# Altium project BEAGLEBONEBLACK_REV A5B.PrjPcb (part 5 of 5)

## Sheet P10_HDMI Framer.SchDoc
size 386 x 246 mm
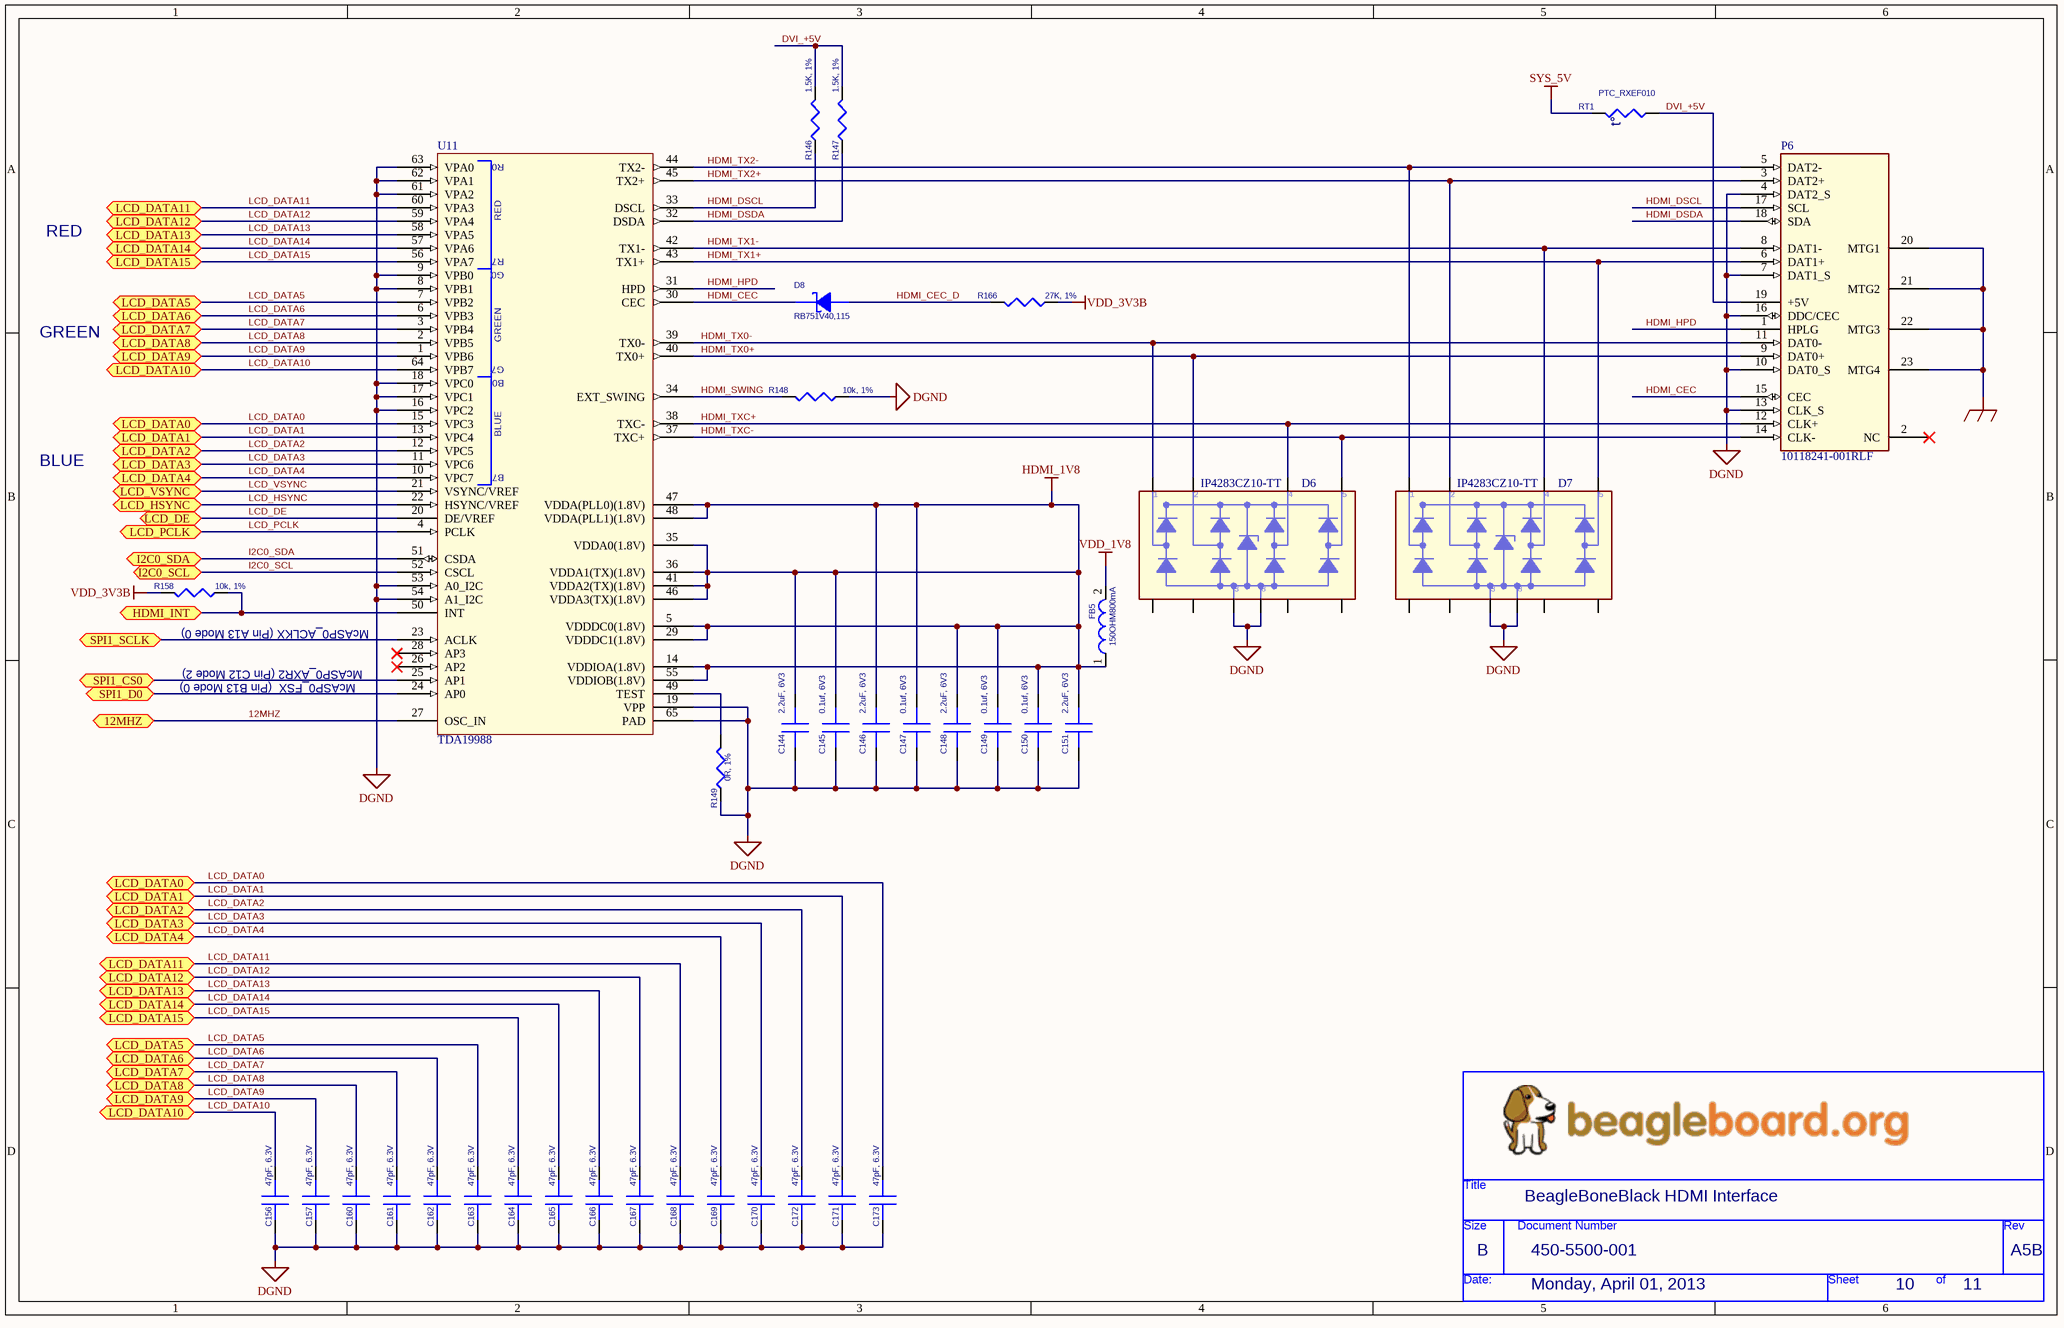
[diagram p12: P10_HDMI Framer.SchDoc]

### Parts
(Parts that share a designator on the sheet are numbered #1, #2 ... from top to bottom, then left to right.)
*#10  Page Create Date: Monday, April 01, 2013  Doc: 450-5500-001  RevCode: A5B  Title: BeagleBoneBlack HDMI Interface  Page Size: B  Page Number: 10  Page Count: 11  (hidden comment: BeagleBoard_org)  (graphical)
C144  2.2uF, 6V3  [402]
C145  0.1uf, 6V3  [402]
C146  2.2uF, 6V3  [402]
C147  0.1uf, 6V3  [402]
C148  2.2uF, 6V3  [402]
C149  0.1uf, 6V3  [402]
C150  0.1uf, 6V3  [402]
C151  2.2uF, 6V3  [402]
C156  47pF, 6.3V  [402]
C157  47pF, 6.3V  [402]
C160  47pF, 6.3V  [402]
C161  47pF, 6.3V  [402]
C162  47pF, 6.3V  [402]
C163  47pF, 6.3V  [402]
C164  47pF, 6.3V  [402]
C165  47pF, 6.3V  [402]
C166  47pF, 6.3V  [402]
C167  47pF, 6.3V  [402]
C168  47pF, 6.3V  [402]
C169  47pF, 6.3V  [402]
C170  47pF, 6.3V  [402]
C171  47pF, 6.3V  [402]
C172  47pF, 6.3V  [402]
C173  47pF, 6.3V  [402]
D6  IP4283CZ10-TT  [TSSOP10]
D7  IP4283CZ10-TT  [TSSOP10]
D8  RB751V40,115  [SOD323]
FB5  150OHM800mA  [SM-7351-IND-0805]
P6  10118241-001RLF  [CONN19_HDMI]
R146  1.5K, 1%  [402]
R147  1.5K, 1%  [402]
R148  10k, 1%  [402]
R149  0R, 1%  [402]
R158  10k, 1%  [402]
R166  27K, 1%  [402]
RT1  PTC_RXEF010  [POLYSW200-5638-310]
U11  TDA19988  [QFN64S9X9P5]

### Ports
12MHZ, HDMI_INT, I2C0_SCL, I2C0_SDA, LCD_DATA0, LCD_DATA1, LCD_DATA2, LCD_DATA3, LCD_DATA4, LCD_DATA5, LCD_DATA6, LCD_DATA7, LCD_DATA8, LCD_DATA9, LCD_DATA10, LCD_DATA11, LCD_DATA12, LCD_DATA13, LCD_DATA14, LCD_DATA15, LCD_DE, LCD_HSYNC, LCD_PCLK, LCD_VSYNC, SPI1_CS0, SPI1_D0, SPI1_SCLK

### Nets
DGND: C144.2 C145.2 C146.2 C147.2 C148.2 C149.2 C150.2 C151.2 C156.2 C157.2 C160.2 C161.2 C162.2 C163.2 C164.2 C165.2 C166.2 C167.2 C168.2 C169.2 C170.2 C171.2 C172.2 C173.2 D6.3 D6.8 D7.3 D7.8 P6.4(DAT2_S) P6.7(DAT1_S) P6.10(DAT0_S) P6.13(CLK_S) P6.16(DDC/CEC) R148.2(P2) R149.2(P2) U11.8(VPB1) U11.9(VPB0) U11.16(VPC2) U11.17(VPC1) U11.18(VPC0) U11.19(VPP) U11.53(A0_I2C) U11.54(A1_I2C) U11.61(VPA2) U11.62(VPA1) U11.63(VPA0) U11.65(PAD)
GND_EARTH: P6.20(MTG1) P6.21(MTG2) P6.22(MTG3) P6.23(MTG4)
HDMI_1V8: C144.1 C145.1 C146.1 C147.1 C148.1 C149.1 C150.1 C151.1 FB5.1 U11.5(VDDDC0(1.8V)) U11.14(VDDIOA(1.8V)) U11.29(VDDDC1(1.8V)) U11.35(VDDA0(1.8V)) U11.36(VDDA1(TX)(1.8V)) U11.41(VDDA2(TX)(1.8V)) U11.46(VDDA3(TX)(1.8V)) U11.47(VDDA(PLL0)(1.8V)) U11.48(VDDA(PLL1)(1.8V)) U11.55(VDDIOB(1.8V))
SYS_5V: RT1.1(P1)
VDD_1V8: FB5.2
VDD_3V3B: R158.1(P1) R166.2(P2)
12MHZ: U11.27(OSC_IN) ; port 12MHZ
DVI_+5V: P6.19(+5V) R146.1(P1) R147.1(P1) RT1.2(P2)
HDMI_CEC: D8.1(C) P6.15(CEC) U11.30(CEC)
HDMI_CEC_D: D8.2(A) R166.1(P1)
HDMI_DSCL: P6.17(SCL) R146.2(P2) U11.33(DSCL)
HDMI_DSDA: P6.18(SDA) R147.2(P2) U11.32(DSDA)
HDMI_HPD: P6.1(HPLG) U11.31(HPD)
HDMI_INT: R158.2(P2) U11.50(INT) ; port HDMI_INT
HDMI_SWING: R148.1(P1) U11.34(EXT_SWING)
HDMI_TX0+: D6.2 P6.9(DAT0+) U11.40(TX0+)
HDMI_TX0-: D6.1 P6.11(DAT0-) U11.39(TX0-)
HDMI_TX1+: D7.5 P6.6(DAT1+) U11.43(TX1+)
HDMI_TX1-: D7.4 P6.8(DAT1-) U11.42(TX1-)
HDMI_TX2+: D7.2 P6.3(DAT2+) U11.45(TX2+)
HDMI_TX2-: D7.1 P6.5(DAT2-) U11.44(TX2-)
HDMI_TXC+: D6.4 P6.12(CLK+) U11.38(TXC-)
HDMI_TXC-: D6.5 P6.14(CLK-) U11.37(TXC+)
I2C0_SCL: U11.52(CSCL) ; port I2C0_SCL
I2C0_SDA: U11.51(CSDA) ; port I2C0_SDA
LCD_DATA0: C173.1 U11.15(VPC3) ; port LCD_DATA0
LCD_DATA1: C171.1 U11.13(VPC4) ; port LCD_DATA1
LCD_DATA2: C172.1 U11.12(VPC5) ; port LCD_DATA2
LCD_DATA3: C170.1 U11.11(VPC6) ; port LCD_DATA3
LCD_DATA4: C169.1 U11.10(VPC7) ; port LCD_DATA4
LCD_DATA5: C163.1 U11.7(VPB2) ; port LCD_DATA5
LCD_DATA6: C162.1 U11.6(VPB3) ; port LCD_DATA6
LCD_DATA7: C161.1 U11.3(VPB4) ; port LCD_DATA7
LCD_DATA8: C160.1 U11.2(VPB5) ; port LCD_DATA8
LCD_DATA9: C157.1 U11.1(VPB6) ; port LCD_DATA9
LCD_DATA10: C156.1 U11.64(VPB7) ; port LCD_DATA10
LCD_DATA11: C168.1 U11.60(VPA3) ; port LCD_DATA11
LCD_DATA12: C167.1 U11.59(VPA4) ; port LCD_DATA12
LCD_DATA13: C166.1 U11.58(VPA5) ; port LCD_DATA13
LCD_DATA14: C165.1 U11.57(VPA6) ; port LCD_DATA14
LCD_DATA15: C164.1 U11.56(VPA7) ; port LCD_DATA15
LCD_DE: U11.20(DE/VREF) ; port LCD_DE
LCD_HSYNC: U11.22(HSYNC/VREF) ; port LCD_HSYNC
LCD_PCLK: U11.4(PCLK) ; port LCD_PCLK
LCD_VSYNC: U11.21(VSYNC/VREF) ; port LCD_VSYNC
SPI1_CS0: U11.25(AP1) ; port SPI1_CS0
SPI1_D0: U11.24(AP0) ; port SPI1_D0
SPI1_SCLK: U11.23(ACLK) ; port SPI1_SCLK
NetR149_1: R149.1(P1) U11.49(TEST)

Not connected (* = marked no-connect by the designer): D6 6 7 9 10; D7 6 7 9 10; P6 2(NC)*; U11 26(AP2)* 28(AP3)*

### Notes on the sheet
- RED
- GREEN
- BLUE
- McASP0_AXR2 (Pin C12 Mode 2)
- (near R158) McASP0_ACLKX (Pin A13 Mode 0)
- McASP0_FSX  (Pin B13 Mode 0)
- (in symbol BeagleBoard_org) Title; Size; Document Number; Rev; Date:; Sheet; of
- (in symbol PTC) t°
- (in symbol TDA19988) R0; RED; R7; G0; GREEN; G7; B0; BLUE; B7

### Library data of the parts
C144 C146 C148 C151 = CAP SMD: CAP CER 2.2UF 6.3V 10% X5R 0402; Manufacturer: TDK Corporation; Manufacturer Part Number: C1005X5R0J225K050BC; Capacitance: 2.2µF; Supplier 1: Digi-Key; Supplier Part Number 1: 445-6847-6-ND; RoHS: RoHS Compliant; Category: Capacitors; Stock 1: 186346; Pricing 1: 1=0.24, 10=0.2, 100=0.1, 250=0.075, 500=0.06626, 1000=0.05875, 5000=0.04875 (USD); Voltage - Rated: 6.3V; Tolerance: ±10%; Temperature Coefficient: X5R; Mounting Type: Surface Mount, MLCC; Operating Temperature: -55°C ~ 85°C; Applications: General Purpose; Ratings: -; Package / Case: 0402 (1005 Metric); Size / Dimension: 0.039" L x 0.020" W (1.00mm x 0.50mm); Height - Seated (Max): -; Thickness (Max): 0.022" (0.55mm); Lead Spacing: -; Features: -; Packaging: Digi-Reel®; Lead Style: -; ComponentLink1URL: http://product.tdk.com/capacitor/mlcc/en/documents/mlcc_commercial_general_en.pdf; ComponentLink1Description: http://product.tdk.com/capacitor/mlcc/en/documents/mlcc_commercial_general_en.pdf
C145 C147 C149 C150 = CAP SMD: CAP CER 0.1UF 6.3V 10% X5R 0402; Manufacturer: TDK Corporation; Manufacturer Part Number: C1005X5R0J104K050BA; Capacitance: 0.1µF; Supplier 1: Digi-Key; Supplier Part Number 1: 445-1266-6-ND; RoHS: RoHS Compliant; Category: Capacitors; Stock 1: 127094; Pricing 1: 1=0.1, 10=0.026, 100=0.0121, 250=0.00992, 500=0.00848, 1000=0.0066, 5000=0.0055 (USD); Voltage - Rated: 6.3V; Tolerance: ±10%; Temperature Coefficient: X5R; Mounting Type: Surface Mount, MLCC; Operating Temperature: -55°C ~ 85°C; Applications: General Purpose; Ratings: -; Package / Case: 0402 (1005 Metric); Size / Dimension: 0.039" L x 0.020" W (1.00mm x 0.50mm); Height - Seated (Max): -; Thickness (Max): 0.022" (0.55mm); Lead Spacing: -; Features: -; Packaging: Digi-Reel®; Lead Style: -; ComponentLink1URL: http://product.tdk.com/capacitor/mlcc/en/documents/mlcc_commercial_general_en.pdf; ComponentLink1Description: http://product.tdk.com/capacitor/mlcc/en/documents/mlcc_commercial_general_en.pdf
C156 C157 C160-C173 = CAP SMD: CAP CER 47PF 50V 5% NP0 0402; Manufacturer: TDK Corporation; Manufacturer Part Number: C1005C0G1H470J050BA; Temperature Coefficient: C0G, NP0; Supplier 1: Digi-Key; Supplier Part Number 1: 445-1243-6-ND; RoHS: RoHS Compliant; Category: Capacitors; Stock 1: 0; Pricing 1: 1=0.1, 10=0.024, 100=0.011, 250=0.009, 500=0.0077, 1000=0.006, 5000=0.005 (USD); Capacitance: 47pF; Voltage - Rated: 50V; Tolerance: ±5%; Mounting Type: Surface Mount, MLCC; Operating Temperature: -55°C ~ 125°C; Applications: General Purpose; Ratings: -; Package / Case: 0402 (1005 Metric); Size / Dimension: 0.039" L x 0.020" W (1.00mm x 0.50mm); Height - Seated (Max): -; Thickness (Max): 0.022" (0.55mm); Lead Spacing: -; Features: -; Packaging: Digi-Reel®; Lead Style: -; ComponentLink1URL: http://product.tdk.com/capacitor/mlcc/en/documents/mlcc_commercial_general_en.pdf; ComponentLink1Description: http://product.tdk.com/capacitor/mlcc/en/documents/mlcc_commercial_general_en.pdf
D6 D7 = 32CTQ030/TO_1: DIODE ESD PROT HDMI 10TSSOP; Manufacturer: NXP Semiconductors; Manufacturer Part Number: IP4283CZ10-TT,118; Voltage - Reverse Standoff (Typ): 3V; Voltage - Breakdown: 6V; Polarization: 4 Channel Array - Unidirectional; Supplier 1: Digi-Key; Supplier Part Number 1: 568-5875-6-ND; RoHS: RoHS Compliant; Category: Circuit Protection; Stock 1: 1067; Pricing 1: 1=0.85, 10=0.743, 25=0.6568, 100=0.5724, 250=0.49828, 500=0.42416, 1000=0.33974 (USD); Power (Watts): -; Mounting Type: Surface Mount; Package / Case: 10-TFSOP, 10-MSOP (0.118", 3.00mm Width); Supplier Device Package: 10-TSSOP; Packaging: Digi-Reel®; ComponentLink1URL: http://media.digikey.com/pdf/Data%20Sheets/NXP%20PDFs/IP4283CZ10.pdf; ComponentLink1Description: http://media.digikey.com/pdf/Data%20Sheets/NXP%20PDFs/IP4283CZ10.pdf
D8 = Zener: DIODE SCHOTTKY 40V 120MA SOD323; Manufacturer: NXP Semiconductors; Current - Average Rectified (Io): 120mA (DC); Voltage - Forward (Vf) (Max) @ If: 370mV @ 1mA; Speed: Small Signal =< 200mA (Io), Any Speed; Current - Reverse Leakage @ Vr: 500nA @ 30V; Capacitance @ Vr, F: 2pF @ 1V, 1MHz; Supplier 1: Digi-Key; Supplier Part Number 1: 568-8119-6-ND; Manufacturer Part Number: RB751V40,115; RoHS: RoHS Compliant; Category: Discrete Semiconductor Products; Stock 1: 5326; Pricing 1: 1=0.29, 10=0.26, 25=0.1872, 100=0.1456, 250=0.09152, 500=0.07798, 1000=0.05313 (USD); Diode Type: Schottky; Voltage - DC Reverse (Vr) (Max): 40V; Reverse Recovery Time (trr): -; Mounting Type: Surface Mount; Package / Case: SC-76, SOD-323; Supplier Device Package: SOD-323; Packaging: Digi-Reel®; ComponentLink1URL: http://www.nxp.com/documents/data_sheet/RB751_SER.pdf; ComponentLink1Description: http://www.nxp.com/documents/data_sheet/RB751_SER.pdf
FB5 = IND: FERRITE 800MA 150 OHM 0805 SMD; Manufacturer: Laird-Signal Integrity Products; Manufacturer Part Number: LI0805H151R-10; Impedance @ Frequency: 150 Ohm @ 100MHz; DC Resistance (DCR): 150 mOhm Max; Filter Type: Differential Mode - Single; Supplier 1: Digi-Key; Supplier Part Number 1: 240-2384-6-ND; RoHS: RoHS Compliant; Category: Filters; Stock 1: 10144; Pricing 1: 1=0.1, 10=0.07, 25=0.064, 50=0.0574, 100=0.0421, 250=0.03064, 500=0.02808, 1000=0.02424 (USD); Current Rating: 800mA; Package / Case: 0805 (2012 Metric); Mounting Type: Surface Mount; Packaging: Digi-Reel®; Height (Max): 0.043" (1.10mm); Size / Dimension: 0.079" L x 0.049" W (2.00mm x 1.25mm); ComponentLink1URL: http://www.lairdtech.com/WorkArea/linkit.aspx?LinkIdentifier=id&ItemID=4912; ComponentLink1Description: http://www.lairdtech.com/WorkArea/linkit.aspx?LinkIdentifier=id&ItemID=4912
P6 = Micro HDMI: CONN HDMI RECPT 19POS SMT R/A; Manufacturer: FCI; Number of Contacts: 19; Gender: Receptacle; Supplier 1: Digi-Key; Supplier Part Number 1: 609-4615-6-ND; Manufacturer Part Number: 10118241-001RLF; RoHS: RoHS Compliant; Category: Connectors, Interconnects; Stock 1: 6779; Pricing 1: 1=1.34, 10=1.174, 25=1.1052, 50=1.059, 100=1.013, 250=0.92092 (USD); Connector Type: HDMI; Specifications: -; Mounting Type: Surface Mount, Right Angle, Horizontal; Features: Shielded, Solder Retention; Packaging: Digi-Reel®; Ingress Protection: -; ComponentLink1URL: http://portal.fciconnect.com/Comergent//fci/drawing/10118241.pdf; ComponentLink1Description: http://portal.fciconnect.com/Comergent//fci/drawing/10118241.pdf
R146 R147 = RES SMD: RES 1.50K OHM 1/16W 1% 0402 SMD; Manufacturer: Yageo; Manufacturer Part Number: RC0402FR-071K5L; Power (Watts): 0.063W, 1/16W; Temperature Coefficient: ±100ppm/°C; Supplier 1: Digi-Key; Supplier Part Number 1: 311-1.50KLRDKR-ND; RoHS: RoHS Compliant; Category: Resistors; Stock 1: 434146; Pricing 1: 1=0.1, 10=0.014, 25=0.0104, 100=0.0063, 250=0.0054, 500=0.00382, 1000=0.0027, 2500=0.00234, 5000=0.00203 (USD); Resistance (Ohms): 1.5k; Composition: Thick Film; Features: -; Tolerance: ±1%; Package / Case: 0402 (1005 Metric); Supplier Device Package: 0402; Size / Dimension: 0.039" L x 0.020" W (1.00mm x 0.50mm); Height: 0.016" (0.40mm); Number of Terminations: 2; Packaging: Digi-Reel®; ComponentLink1URL: http://www.yageo.com/documents/recent/PYu-RC0402_51_RoHS_L_6.pdf; ComponentLink1Description: http://www.yageo.com/documents/recent/PYu-RC0402_51_RoHS_L_6.pdf
R148 R158 = RES SMD: RES 10K OHM 1/16W 5% 0402 SMD; Manufacturer: Rohm Semiconductor; Manufacturer Part Number: MCR01MZPJ103; Power (Watts): 0.063W, 1/16W; Temperature Coefficient: ±200ppm/°C; Supplier 1: Digi-Key; Supplier Part Number 1: RHM10KJDKR-ND; RoHS: RoHS Compliant; Category: Resistors; Stock 1: 460442; Pricing 1: 1=0.1, 10=0.019, 25=0.014, 100=0.0078, 250=0.00596, 500=0.00476, 1000=0.0035, 5000=0.00251 (USD); Resistance (Ohms): 10k; Composition: Thick Film; Features: Automotive AEC-Q200 Qualified; Tolerance: ±5%; Package / Case: 0402 (1005 Metric); Supplier Device Package: 0402 (1005 Metric); Size / Dimension: 0.039" L x 0.020" W (1.00mm x 0.50mm); Height: 0.016" (0.40mm); Number of Terminations: 2; Packaging: Digi-Reel®; ComponentLink1URL: http://rohmfs.rohm.com/en/products/databook/datasheet/passive/resistor/chip_resistor/mcr_a.pdf; ComponentLink1Description: http://rohmfs.rohm.com/en/products/databook/datasheet/passive/resistor/chip_resistor/mcr_a.pdf
R149 = RES SMD: RES 0.0 OHM 1/16W 0402 SMD; Manufacturer: Yageo; Manufacturer Part Number: RC0402JR-070RL; Resistance (Ohms): 0.0; Power (Watts): 0.063W, 1/16W; Tolerance: Jumper; Supplier 1: Digi-Key; Supplier Part Number 1: 311-0.0JRDKR-ND; RoHS: RoHS Compliant; Category: Resistors; Stock 1: 4565215; Pricing 1: 1=0.1, 10=0.012, 25=0.0092, 100=0.0055, 250=0.00476, 500=0.00336, 1000=0.00237, 2500=0.00206, 5000=0.00178 (USD); Composition: Thick Film; Features: -; Temperature Coefficient: -; Package / Case: 0402 (1005 Metric); Supplier Device Package: 0402; Size / Dimension: 0.039" L x 0.020" W (1.00mm x 0.50mm); Height: 0.016" (0.40mm); Number of Terminations: 2; Packaging: Digi-Reel®; ComponentLink1URL: http://www.yageo.com/documents/recent/PYu-RC0402_51_RoHS_L_6.pdf; ComponentLink1Description: http://www.yageo.com/documents/recent/PYu-RC0402_51_RoHS_L_6.pdf
R166 = RES SMD: RES 27.0K OHM 1/16W 1% 0402 SMD; Manufacturer: Yageo; Manufacturer Part Number: RC0402FR-0727KL; Power (Watts): 0.063W, 1/16W; Temperature Coefficient: ±100ppm/°C; Supplier 1: Digi-Key; Supplier Part Number 1: 311-27.0KLRDKR-ND; RoHS: RoHS Compliant; Category: Resistors; Stock 1: 115508; Pricing 1: 1=0.1, 10=0.014, 25=0.0104, 100=0.0063, 250=0.0054, 500=0.00382, 1000=0.0027, 2500=0.00234, 5000=0.00203 (USD); Resistance (Ohms): 27k; Composition: Thick Film; Features: -; Tolerance: ±1%; Package / Case: 0402 (1005 Metric); Supplier Device Package: 0402; Size / Dimension: 0.039" L x 0.020" W (1.00mm x 0.50mm); Height: 0.016" (0.40mm); Number of Terminations: 2; Packaging: Digi-Reel®; ComponentLink1URL: http://www.yageo.com/documents/recent/PYu-RC0402_51_RoHS_L_6.pdf; ComponentLink1Description: http://www.yageo.com/documents/recent/PYu-RC0402_51_RoHS_L_6.pdf
RT1 = PTC: POLYSWITCH PTC RESET 0.1A; Manufacturer: TE Connectivity; Current - Hold (Ih) (Max): 100mA; Current - Trip (It): 200mA; Current - Max: 40A; Voltage - Max: 60V; R Min/Max: 2.500 ~ 4.500 Ohm; Time to Trip: 4s; Supplier 1: Digi-Key; Supplier Part Number 1: RXEF010-ND; Manufacturer Part Number: RXEF010; RoHS: RoHS Compliant; Category: Circuit Protection; Stock 1: 22325; Pricing 1: 1=0.32, 10=0.289, 100=0.2625, 500=0.20476, 1000=0.1764, 5000=0.1617, 10000=0.1365, 50000=0.13125, 100000=0.126 (USD); Package / Case: Radial, Disc; Packaging: Bulk; ComponentLink1URL: http://documents.tycoelectronics.com/commerce/DocumentDelivery/DDEController?Action=showdoc&DocId=Specification+Or+Standard%7FSCD25213%7FE%7Fpdf%7FEnglish%7FENG_SS_SCD25213_E.pdf; ComponentLink1Description: http://documents.tycoelectronics.com/commerce/DocumentDelivery/DDEController?Action=showdoc&DocId=Specification+Or+Standard%7FSCD25213%7FE%7Fpdf%7FEnglish%7FENG_SS_SCD25213_E.pdf
U11 = TDA19988: IC HDMI TRANSMITTER 64-HVQFN; Manufacturer: NXP Semiconductors; Manufacturer Part Number: TDA19988AHN/C1,551; Supplier 1: Digi-Key; Supplier Part Number 1: TDA19988AHN/C1,551-ND; RoHS: RoHS Compliant; Category: Integrated Circuits (ICs); Stock 1: 0; Pricing 1: 260=4.59 (USD); Type: HDMI Transmitter; Applications: Set-Top Boxes; Mounting Type: Surface Mount; Package / Case: 64-VFQFN Exposed Pad; Supplier Device Package: 64-HVQFN (9x9); Packaging: Tray

## Sheet P11_Exp Conn, uSD, and .SchDoc
size 386 x 246 mm
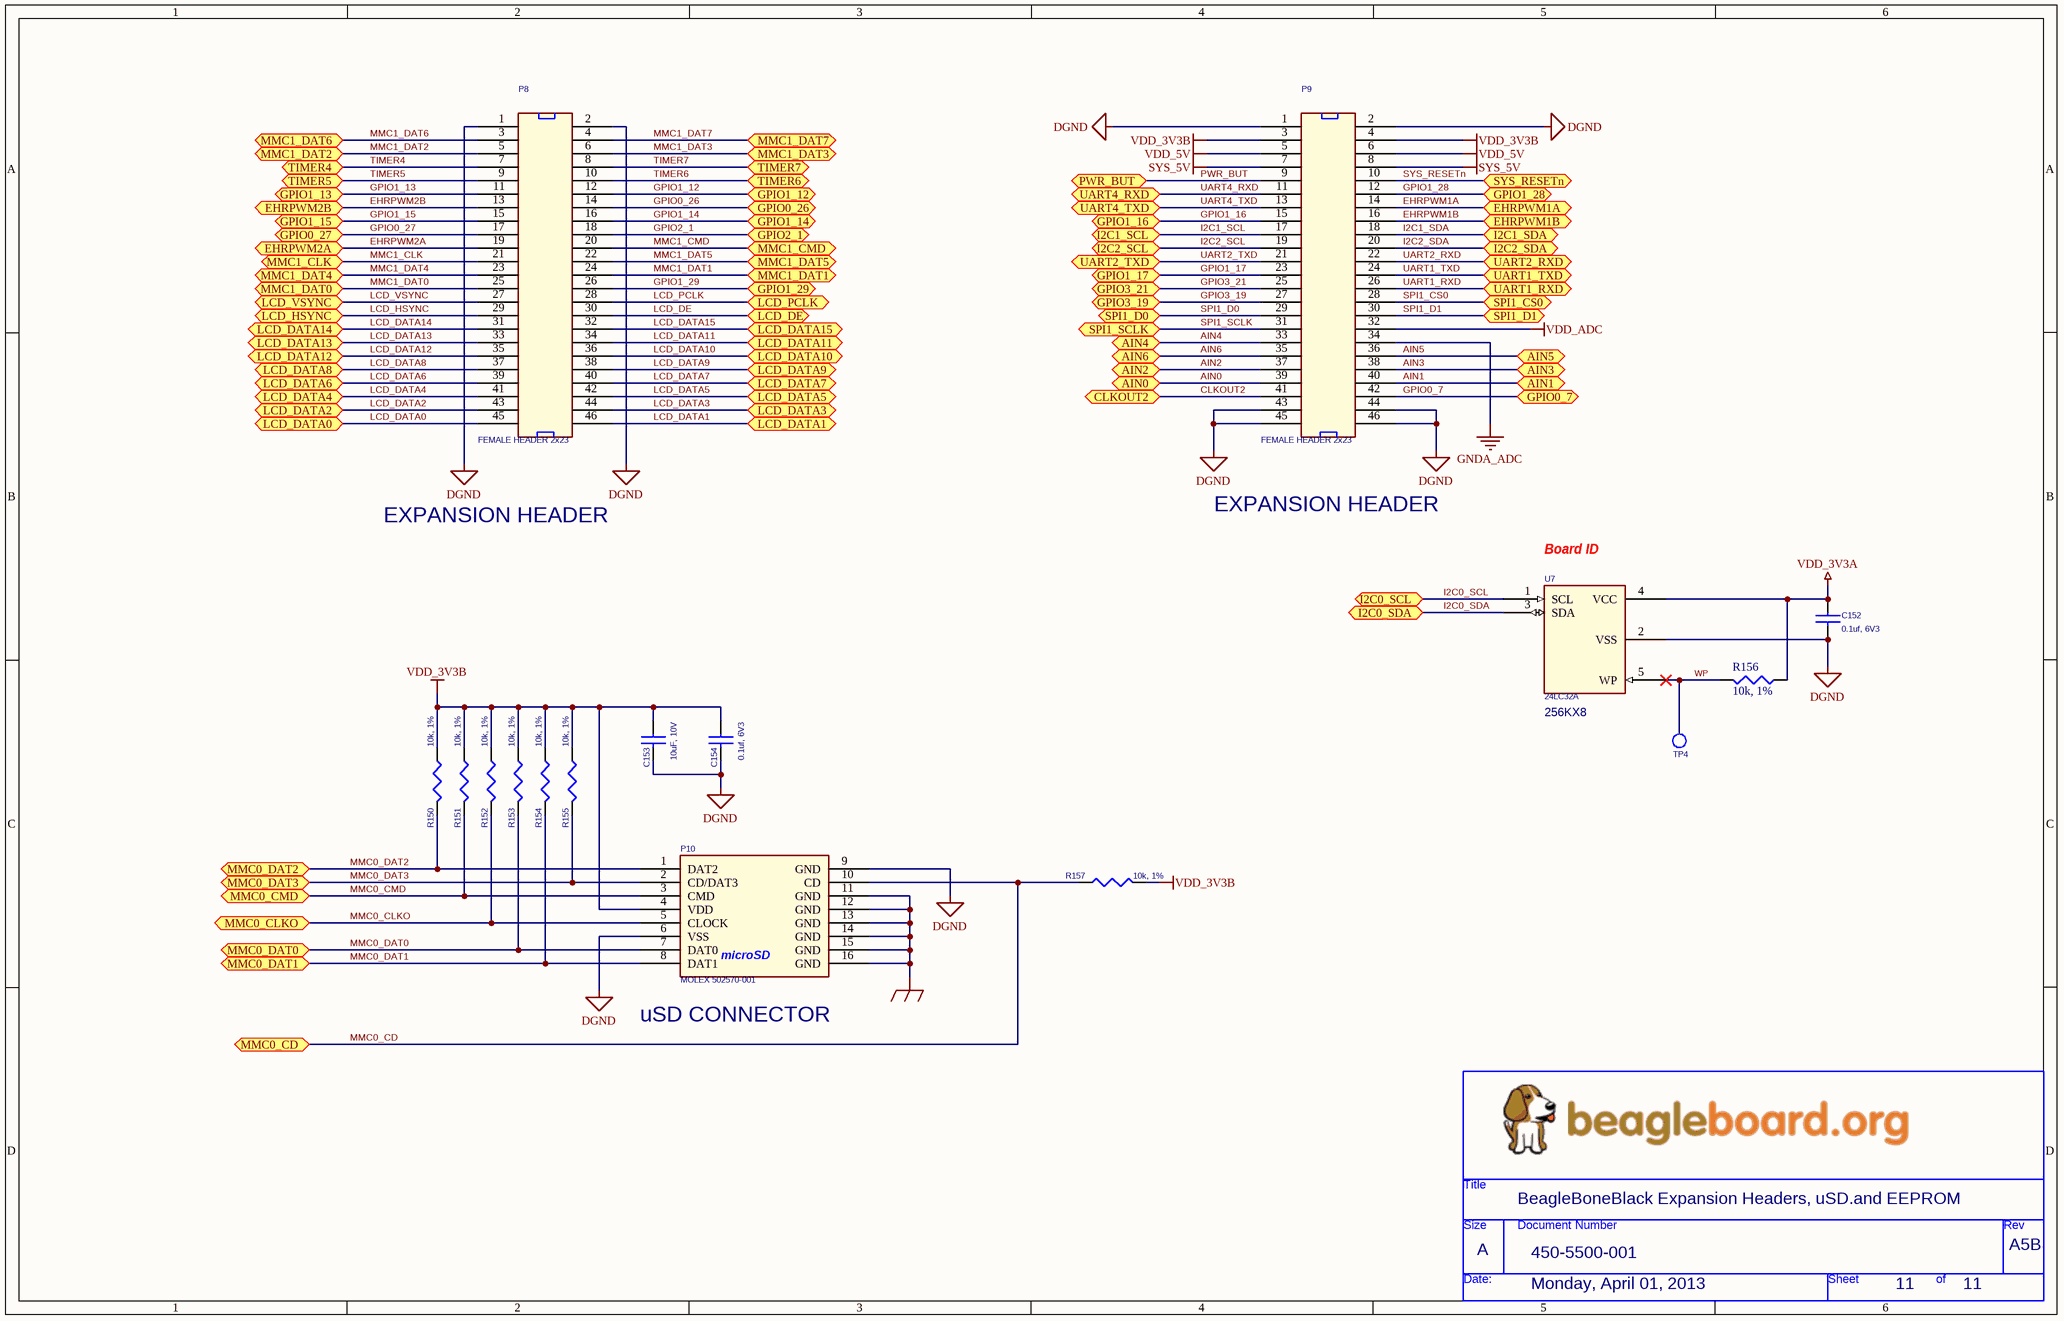
[diagram p13: P11_Exp Conn, uSD, and .SchDoc]

### Parts
(Parts that share a designator on the sheet are numbered #1, #2 ... from top to bottom, then left to right.)
*#11  Page Create Date: Monday, April 01, 2013  Doc: 450-5500-001  RevCode: A5B  Title: BeagleBoneBlack Expansion Headers, uSD.and EEPROM  Page Size: A  Page Number: 11  (hidden comment: BeagleBoard_org)  (graphical)
C152  0.1uf, 6V3  [402]
C153  10uF, 10V  [805]
C154  0.1uf, 6V3  [402]
P8  FEMALE HEADER 2x23  [HEADER23X2]
P9  FEMALE HEADER 2x23  [HEADER23X2]
P10  MOLEX 502570-001  [SD-MICRO-SCHA5B0300]
R150  10k, 1%  [402]
R151  10k, 1%  [402]
R152  10k, 1%  [402]
R153  10k, 1%  [402]
R154  10k, 1%  [402]
R155  10k, 1%  [402]
R156  10k, 1%  [402]
R157  10k, 1%  [402]
TP4  TESTPT1  [tp1-8040]  (value not drawn)  (no BOM)
U7  24LC32A  [SOT23-5]

### Ports
AIN0, AIN1, AIN2, AIN3, AIN4, AIN5, AIN6, CLKOUT2, EHRPWM1A, EHRPWM1B, EHRPWM2A, EHRPWM2B, GPIO0_7, GPIO0_26, GPIO0_27, GPIO1_12, GPIO1_13, GPIO1_14, GPIO1_15, GPIO1_16, GPIO1_17, GPIO1_28, GPIO1_29, GPIO2_1, GPIO3_19, GPIO3_21, I2C0_SCL, I2C0_SDA, I2C1_SCL, I2C1_SDA, I2C2_SCL, I2C2_SDA, LCD_DATA0, LCD_DATA1, LCD_DATA2, LCD_DATA3, LCD_DATA4, LCD_DATA5, LCD_DATA6, LCD_DATA7, LCD_DATA8, LCD_DATA9, LCD_DATA10, LCD_DATA11, LCD_DATA12, LCD_DATA13, LCD_DATA14, LCD_DATA15, LCD_DE, LCD_HSYNC, LCD_PCLK, LCD_VSYNC, MMC0_CD, MMC0_CLKO, MMC0_CMD, MMC0_DAT0, MMC0_DAT1, MMC0_DAT2, MMC0_DAT3, MMC1_CLK, MMC1_CMD, MMC1_DAT0, MMC1_DAT1, MMC1_DAT2, MMC1_DAT3, MMC1_DAT4, MMC1_DAT5, MMC1_DAT6, MMC1_DAT7, PWR_BUT, SPI1_CS0, SPI1_D0, SPI1_D1, SPI1_SCLK, SYS_RESETn, TIMER4, TIMER5, TIMER6, TIMER7, UART1_RXD, UART1_TXD, UART2_RXD, UART2_TXD, UART4_RXD, UART4_TXD

### Nets
DGND: C152.2 C153.2 C154.2 P8.1 P8.2 P9.1 P9.2 P9.43 P9.44 P9.45 P9.46 P10.6(VSS) P10.9(GND) U7.2(VSS)
GND_EARTH: P10.11(GND) P10.12(GND) P10.13(GND) P10.14(GND) P10.15(GND) P10.16(GND)
GNDA_ADC: P9.34
SYS_5V: P9.7 P9.8
VDD_3V3A: C152.1 R156.1 U7.4(VCC)
VDD_3V3B: C153.1 C154.1 P9.3 P9.4 P10.4(VDD) R150.1 R151.1 R152.1 R153.1 R154.1 R155.1 R157.2
VDD_5V: P9.5 P9.6
VDD_ADC: P9.32
AIN0: P9.39 ; port AIN0
AIN1: P9.40 ; port AIN1
AIN2: P9.37 ; port AIN2
AIN3: P9.38 ; port AIN3
AIN4: P9.33 ; port AIN4
AIN5: P9.36 ; port AIN5
AIN6: P9.35 ; port AIN6
CLKOUT2: P9.41 ; port CLKOUT2
EHRPWM1A: P9.14 ; port EHRPWM1A
EHRPWM1B: P9.16 ; port EHRPWM1B
EHRPWM2A: P8.19 ; port EHRPWM2A
EHRPWM2B: P8.13 ; port EHRPWM2B
GPIO0_7: P9.42 ; port GPIO0_7
GPIO0_26: P8.14 ; port GPIO0_26
GPIO0_27: P8.17 ; port GPIO0_27
GPIO1_12: P8.12 ; port GPIO1_12
GPIO1_13: P8.11 ; port GPIO1_13
GPIO1_14: P8.16 ; port GPIO1_14
GPIO1_15: P8.15 ; port GPIO1_15
GPIO1_16: P9.15 ; port GPIO1_16
GPIO1_17: P9.23 ; port GPIO1_17
GPIO1_28: P9.12 ; port GPIO1_28
GPIO1_29: P8.26 ; port GPIO1_29
GPIO2_1: P8.18 ; port GPIO2_1
GPIO3_19: P9.27 ; port GPIO3_19
GPIO3_21: P9.25 ; port GPIO3_21
I2C0_SCL: U7.1(SCL) ; port I2C0_SCL
I2C0_SDA: U7.3(SDA) ; port I2C0_SDA
I2C1_SCL: P9.17 ; port I2C1_SCL
I2C1_SDA: P9.18 ; port I2C1_SDA
I2C2_SCL: P9.19 ; port I2C2_SCL
I2C2_SDA: P9.20 ; port I2C2_SDA
LCD_DATA0: P8.45 ; port LCD_DATA0
LCD_DATA1: P8.46 ; port LCD_DATA1
LCD_DATA2: P8.43 ; port LCD_DATA2
LCD_DATA3: P8.44 ; port LCD_DATA3
LCD_DATA4: P8.41 ; port LCD_DATA4
LCD_DATA5: P8.42 ; port LCD_DATA5
LCD_DATA6: P8.39 ; port LCD_DATA6
LCD_DATA7: P8.40 ; port LCD_DATA7
LCD_DATA8: P8.37 ; port LCD_DATA8
LCD_DATA9: P8.38 ; port LCD_DATA9
LCD_DATA10: P8.36 ; port LCD_DATA10
LCD_DATA11: P8.34 ; port LCD_DATA11
LCD_DATA12: P8.35 ; port LCD_DATA12
LCD_DATA13: P8.33 ; port LCD_DATA13
LCD_DATA14: P8.31 ; port LCD_DATA14
LCD_DATA15: P8.32 ; port LCD_DATA15
LCD_DE: P8.30 ; port LCD_DE
LCD_HSYNC: P8.29 ; port LCD_HSYNC
LCD_PCLK: P8.28 ; port LCD_PCLK
LCD_VSYNC: P8.27 ; port LCD_VSYNC
MMC0_CD: P10.10(CD) R157.1 ; port MMC0_CD
MMC0_CLKO: P10.5(CLOCK) R152.2 ; port MMC0_CLKO
MMC0_CMD: P10.3(CMD) R151.2 ; port MMC0_CMD
MMC0_DAT0: P10.7(DAT0) R153.2 ; port MMC0_DAT0
MMC0_DAT1: P10.8(DAT1) R154.2 ; port MMC0_DAT1
MMC0_DAT2: P10.1(DAT2) R150.2 ; port MMC0_DAT2
MMC0_DAT3: P10.2(CD/DAT3) R155.2 ; port MMC0_DAT3
MMC1_CLK: P8.21 ; port MMC1_CLK
MMC1_CMD: P8.20 ; port MMC1_CMD
MMC1_DAT0: P8.25 ; port MMC1_DAT0
MMC1_DAT1: P8.24 ; port MMC1_DAT1
MMC1_DAT2: P8.5 ; port MMC1_DAT2
MMC1_DAT3: P8.6 ; port MMC1_DAT3
MMC1_DAT4: P8.23 ; port MMC1_DAT4
MMC1_DAT5: P8.22 ; port MMC1_DAT5
MMC1_DAT6: P8.3 ; port MMC1_DAT6
MMC1_DAT7: P8.4 ; port MMC1_DAT7
PWR_BUT: P9.9 ; port PWR_BUT
SPI1_CS0: P9.28 ; port SPI1_CS0
SPI1_D0: P9.29 ; port SPI1_D0
SPI1_D1: P9.30 ; port SPI1_D1
SPI1_SCLK: P9.31 ; port SPI1_SCLK
SYS_RESETn: P9.10 ; port SYS_RESETn
TIMER4: P8.7 ; port TIMER4
TIMER5: P8.9 ; port TIMER5
TIMER6: P8.10 ; port TIMER6
TIMER7: P8.8 ; port TIMER7
UART1_RXD: P9.26 ; port UART1_RXD
UART1_TXD: P9.24 ; port UART1_TXD
UART2_RXD: P9.22 ; port UART2_RXD
UART2_TXD: P9.21 ; port UART2_TXD
UART4_RXD: P9.11 ; port UART4_RXD
UART4_TXD: P9.13 ; port UART4_TXD
WP: R156.2 TP4.1(TP) U7.5(WP)

### Notes on the sheet
- EXPANSION HEADER
- (near U7) Board ID
- (near U7) 256KX8
- (near P10) uSD CONNECTOR
- (in symbol BeagleBoard_org) Title; Size; Document Number; Rev; Date:; Sheet; of
- (in symbol microSD_CONN_2) microSD

### Library data of the parts
C152 C154 = CAP_0.1uF_X7R_16V_10% 0402: CAP CER 0.1UF 6.3V 10% X5R 0402; Manufacturer: TDK Corporation; Manufacturer Part Number: C1005X5R0J104K050BA; Capacitance: 0.1µF; Supplier 1: Digi-Key; Supplier Part Number 1: 445-1266-6-ND; RoHS: RoHS Compliant; Category: Capacitors; Stock 1: 127094; Pricing 1: 1=0.1, 10=0.026, 100=0.0121, 250=0.00992, 500=0.00848, 1000=0.0066, 5000=0.0055 (USD); Voltage - Rated: 6.3V; Tolerance: ±10%; Temperature Coefficient: X5R; Mounting Type: Surface Mount, MLCC; Operating Temperature: -55°C ~ 85°C; Applications: General Purpose; Ratings: -; Package / Case: 0402 (1005 Metric); Size / Dimension: 0.039" L x 0.020" W (1.00mm x 0.50mm); Height - Seated (Max): -; Thickness (Max): 0.022" (0.55mm); Lead Spacing: -; Features: -; Packaging: Digi-Reel®; Lead Style: -; ComponentLink1URL: http://product.tdk.com/capacitor/mlcc/en/documents/mlcc_commercial_general_en.pdf; ComponentLink1Description: http://product.tdk.com/capacitor/mlcc/en/documents/mlcc_commercial_general_en.pdf
C153 = CAP_10uF_Y5V_10V_10%_0805: CAP CER 10UF 10V Y5V 0805; Manufacturer: TDK Corporation; Manufacturer Part Number: C2012Y5V1A106Z; Capacitance: 10µF; Temperature Coefficient: Y5V (F); Tolerance: -20%, +80%; Applications: General Purpose; Category: Capacitors; ComponentLink1Description: http://media.digikey.com/pdf/Data%20Sheets/TDK%20PDFs/C_Series_GeneralAppl_B11.pdf; ComponentLink1URL: http://media.digikey.com/pdf/Data%20Sheets/TDK%20PDFs/C_Series_GeneralAppl_B11.pdf; Features: -; Height - Seated (Max): -; Lead Spacing: -; Lead Style: -; Mounting Type: Surface Mount, MLCC; Operating Temperature: -30°C ~ 85°C; Package / Case: 0805 (2012 Metric); Packaging: Digi-Reel®; Pricing 1: 1=0.15, 10=0.105, 100=0.0499, 250=0.042, 500=0.03518, 1000=0.02887 (USD); Ratings: -; RoHS: RoHS Compliant; Size / Dimension: 0.079" L x 0.049" W (2.00mm x 1.25mm); Stock 1: 111942; Supplier 1: Digi-Key; Supplier Part Number 1: 445-1371-6-ND; Thickness (Max): 0.057" (1.45mm); Voltage - Rated: 10V
P8 P9 = HDR_46_F_2_0.1_0.1: CONN HEADER FMAL 46PS.1" DL GOLD; Manufacturer: Sullins Connector Solutions; Manufacturer Part Number: PPPC232LFBN-RC; Number of Positions: 46; Number of Positions Loaded: All; Pitch: 0.100" (2.54mm); Supplier 1: Digi-Key; Supplier Part Number 1: S7126-ND; RoHS: RoHS Compliant; Category: Connectors, Interconnects; Stock 1: 750; Pricing 1: 1=2.75, 10=2.325, 25=2.2196, 50=2.0084, 100=1.7969, 250=1.58552, 500=1.4798, 1000=1.3741, 2500=1.32125 (USD); Connector Type: Header; Contact Type: Female Socket; Number of Rows: 2; Row Spacing: 0.100" (2.54mm); Mounting Type: Through Hole; Termination: Solder; Fastening Type: -; Features: -; Contact Finish: Gold; Contact Finish Thickness: Flash; Color: Black; Packaging: Bulk; ComponentLink1URL: http://www.sullinscorp.com/drawings/78_P(N)PxCxxxLFBN-RC,_10492-G.pdf; ComponentLink1Description: http://www.sullinscorp.com/drawings/78_P(N)PxCxxxLFBN-RC,_10492-G.pdf
P10 = microSD_CONN_2: CONN MICRO SD R/A PUSH-PUSH SMD; Manufacturer: Molex Inc; Manufacturer Part Number: 5025700893; Card Type: Secure Digital - microSD™ TransFlash; Number of Positions: 10 (8 + 2); Connector Type: Connector and Ejector; Insertion, Removal Method: Push In, Push Out; Supplier 1: Digi-Key; Supplier Part Number 1: WM19093TR-ND; RoHS: RoHS Compliant; Category: Connectors, Interconnects; Stock 1: 16900; Pricing 1: 1300=2.16645, 2600=2.01703, 6500=1.94233 (USD); Ejector Side: -; Mounting Type: Surface Mount, Right Angle; Features: Switch; Height Above Board: 0.071" (1.80mm); Mounting Feature: Normal, Standard - Top; Packaging: Tape & Reel (TR); Contact Finish: Gold; Contact Finish Thickness: 20µin (0.51µm); ComponentLink1URL: http://www.molex.com/pdm_docs/sd/5025700893_sd.pdf; ComponentLink1Description: http://www.molex.com/pdm_docs/sd/5025700893_sd.pdf
R150-R157 = RES_10K_1/16W_1%_0402: RES 10K OHM 1/16W 5% 0402 SMD; Manufacturer: Rohm Semiconductor; Manufacturer Part Number: MCR01MZPJ103; Power (Watts): 0.063W, 1/16W; Temperature Coefficient: ±200ppm/°C; Category: Resistors; ComponentLink1Description: http://rohmfs.rohm.com/en/products/databook/datasheet/passive/resistor/chip_resistor/mcr_a.pdf; ComponentLink1URL: http://rohmfs.rohm.com/en/products/databook/datasheet/passive/resistor/chip_resistor/mcr_a.pdf; Composition: Thick Film; Features: Automotive AEC-Q200 Qualified; Height: 0.016" (0.40mm); Number of Terminations: 2; Package / Case: 0402 (1005 Metric); Packaging: Digi-Reel®; Pricing 1: 1=0.1, 10=0.019, 25=0.014, 100=0.0078, 250=0.00596, 500=0.00476, 1000=0.0035, 5000=0.00251 (USD); Resistance (Ohms): 10k; RoHS: RoHS Compliant; Size / Dimension: 0.039" L x 0.020" W (1.00mm x 0.50mm); Stock 1: 110842; Supplier 1: Digi-Key; Supplier Device Package: 0402 (1005 Metric); Supplier Part Number 1: RHM10KJDKR-ND; Tolerance: ±5%
U7 = 24LC32A: IC EEPROM 32KBIT 400KHZ SOT23-5; Manufacturer: Microchip Technology; Manufacturer Part Number: 24LC32AT-I/OT; Format - Memory: EEPROMs - Serial; Memory Size: 32K (4K x 8); Interface: I²C, 2-Wire Serial; Voltage - Supply: 2.5 V ~ 5.5 V; Supplier 1: Digi-Key; Supplier Part Number 1: 24LC32AT-I/OTDKR-ND; RoHS: RoHS Compliant; Category: Integrated Circuits (ICs); Stock 1: 8694; Pricing 1: 1=0.5, 10=0.32, 25=0.31, 100=0.3 (USD); Memory Type: EEPROM; Speed: 400kHz; Operating Temperature: -40°C ~ 85°C; Package / Case: SC-74A, SOT-753; Supplier Device Package: SOT-23-5; Packaging: Digi-Reel®; ComponentLink1URL: http://ww1.microchip.com/downloads/en/DeviceDoc/21713M.pdf; ComponentLink1Description: http://ww1.microchip.com/downloads/en/DeviceDoc/21713M.pdf
*#11 = BeagleBoard_org: Page Count: 11

## Nets that join several sheets
DDR_VREF: P03_Processor 1 of 3, JTAG Header (C28.1 U5.J4), P07_DDR3 Memory (6 pins)
DGND: P02_Power Management (32 pins), P03_Processor 1 of 3, JTAG Header (20 pins), P04_Processor 2 or 3, USB and Serial (17 pins), P05_Processor Page 3 of 3 (111 pins), P06_LED, Config, & Button (26 pins), P07_DDR3 Memory (42 pins), P08_eMMC (15 pins), P09_Ethernet (25 pins), P10_HDMI Framer (47 pins), P11_Exp Conn, uSD, and  (14 pins)
GND_EARTH: P02_Power Management (MTG1.1 MTG2.1 MTG3.1 MTG4.1), P04_Processor 2 or 3, USB and Serial (6 pins), P09_Ethernet (P5.13 P5.14 R136.2), P10_HDMI Framer (P6.20 P6.21 P6.22 P6.23), P11_Exp Conn, uSD, and  (6 pins)
GNDA_ADC: P04_Processor 2 or 3, USB and Serial (C31.2 C32.2 C33.2 U5.A9), P05_Processor Page 3 of 3 (C93.2 FB3.1 U5.E8), P11_Exp Conn, uSD, and  (P9.34)
SYS_5V: P02_Power Management (14 pins), P04_Processor 2 or 3, USB and Serial (C34.1 U8.2 U8.3), P06_LED, Config, & Button (R71.1 R72.1 R73.1 R74.1), P10_HDMI Framer (RT1.1), P11_Exp Conn, uSD, and  (P9.7 P9.8)
USB_DC: P02_Power Management (C1.2 U2.12), P04_Processor 2 or 3, USB and Serial (C36.1 P4.1 R159.1 U10.6)
VDD_1V8: P02_Power Management (C14.2 R9.2 U2.40), P05_Processor Page 3 of 3 (9 pins), P10_HDMI Framer (FB5.2)
VDD_3V3A: P02_Power Management (5 pins), P03_Processor 1 of 3, JTAG Header (9 pins), P04_Processor 2 or 3, USB and Serial (R52.1), P05_Processor Page 3 of 3 (42 pins), P06_LED, Config, & Button (16 pins), P11_Exp Conn, uSD, and  (C152.1 R156.1 U7.4)
VDD_3V3B: P02_Power Management (C20.1 R11.1 U4.3), P03_Processor 1 of 3, JTAG Header (C29.1 P2.5 R23.1 R24.1), P04_Processor 2 or 3, USB and Serial (C155.2 R163.1 U15.7 U15.8), P08_eMMC (25 pins), P09_Ethernet (7 pins), P10_HDMI Framer (R158.1 R166.2), P11_Exp Conn, uSD, and  (12 pins)
VDD_5V: P02_Power Management (C2.2 P1.1 U2.10), P11_Exp Conn, uSD, and  (P9.5 P9.6)
VDD_ADC: P04_Processor 2 or 3, USB and Serial (R27.1), P05_Processor Page 3 of 3 (C93.1 FB2.1 U5.D8), P11_Exp Conn, uSD, and  (P9.32)
VDD_CORE: P02_Power Management (C11.2 L3.2 U2.29), P05_Processor Page 3 of 3 (37 pins)
VDD_MPU: P02_Power Management (C12.2 L2.2 U2.24), P05_Processor Page 3 of 3 (11 pins)
VDDS: P02_Power Management (R8.2 R9.1), P05_Processor Page 3 of 3 (13 pins)
VDDS_DDR: P02_Power Management (C9.2 R6.2), P05_Processor Page 3 of 3 (16 pins), P07_DDR3 Memory (36 pins)
VRTC: P02_Power Management (C16.1 R5.2), P04_Processor 2 or 3, USB and Serial (R26.1), P05_Processor Page 3 of 3 (C105.1 U5.D7)
12MHZ: P03_Processor 1 of 3, JTAG Header (R21.2), P10_HDMI Framer (U11.27)
AIN0: P04_Processor 2 or 3, USB and Serial (U5.B6), P11_Exp Conn, uSD, and  (P9.39)
AIN1: P04_Processor 2 or 3, USB and Serial (U5.C7), P11_Exp Conn, uSD, and  (P9.40)
AIN2: P04_Processor 2 or 3, USB and Serial (U5.B7), P11_Exp Conn, uSD, and  (P9.37)
AIN3: P04_Processor 2 or 3, USB and Serial (U5.A7), P11_Exp Conn, uSD, and  (P9.38)
AIN4: P04_Processor 2 or 3, USB and Serial (U5.C8), P11_Exp Conn, uSD, and  (P9.33)
AIN5: P04_Processor 2 or 3, USB and Serial (U5.B8), P11_Exp Conn, uSD, and  (P9.36)
AIN6: P04_Processor 2 or 3, USB and Serial (U5.A8), P11_Exp Conn, uSD, and  (P9.35)
CLKOUT2: P03_Processor 1 of 3, JTAG Header (P2.18 R19.2 R20.1), P11_Exp Conn, uSD, and  (P9.41)
DDR_A0: P03_Processor 1 of 3, JTAG Header (U5.F3), P07_DDR3 Memory (U12.N3)
DDR_A1: P03_Processor 1 of 3, JTAG Header (U5.H1), P07_DDR3 Memory (U12.P7)
DDR_A2: P03_Processor 1 of 3, JTAG Header (U5.E4), P07_DDR3 Memory (U12.P3)
DDR_A3: P03_Processor 1 of 3, JTAG Header (U5.C3), P07_DDR3 Memory (U12.N2)
DDR_A4: P03_Processor 1 of 3, JTAG Header (U5.C2), P07_DDR3 Memory (U12.P8)
DDR_A5: P03_Processor 1 of 3, JTAG Header (U5.B1), P07_DDR3 Memory (U12.P2)
DDR_A6: P03_Processor 1 of 3, JTAG Header (U5.D5), P07_DDR3 Memory (U12.R8)
DDR_A7: P03_Processor 1 of 3, JTAG Header (U5.E2), P07_DDR3 Memory (U12.R2)
DDR_A8: P03_Processor 1 of 3, JTAG Header (U5.D4), P07_DDR3 Memory (U12.T8)
DDR_A9: P03_Processor 1 of 3, JTAG Header (U5.C1), P07_DDR3 Memory (U12.R3)
DDR_A10: P03_Processor 1 of 3, JTAG Header (U5.F4), P07_DDR3 Memory (U12.L7)
DDR_A11: P03_Processor 1 of 3, JTAG Header (U5.F2), P07_DDR3 Memory (U12.R7)
DDR_A12: P03_Processor 1 of 3, JTAG Header (U5.E3), P07_DDR3 Memory (U12.N7)
DDR_A13: P03_Processor 1 of 3, JTAG Header (U5.H3), P07_DDR3 Memory (U12.T3)
DDR_A14: P03_Processor 1 of 3, JTAG Header (U5.H4), P07_DDR3 Memory (U12.T7)
DDR_A15: P03_Processor 1 of 3, JTAG Header (U5.D3), P07_DDR3 Memory (U12.M7)
DDR_BA0: P03_Processor 1 of 3, JTAG Header (U5.C4), P07_DDR3 Memory (U12.M2)
DDR_BA1: P03_Processor 1 of 3, JTAG Header (U5.E1), P07_DDR3 Memory (U12.N8)
DDR_BA2: P03_Processor 1 of 3, JTAG Header (U5.B3), P07_DDR3 Memory (U12.M3)
DDR_CASn: P03_Processor 1 of 3, JTAG Header (U5.F1), P07_DDR3 Memory (U12.K3)
DDR_CKE: P03_Processor 1 of 3, JTAG Header (U5.G3), P07_DDR3 Memory (R96.2 U12.K9)
DDR_CLK: P03_Processor 1 of 3, JTAG Header (U5.D2), P07_DDR3 Memory (U12.J7)
DDR_CLKn: P03_Processor 1 of 3, JTAG Header (U5.D1), P07_DDR3 Memory (U12.K7)
DDR_CSn: P03_Processor 1 of 3, JTAG Header (U5.H2), P07_DDR3 Memory (U12.L2)
DDR_D0: P03_Processor 1 of 3, JTAG Header (U5.M3), P07_DDR3 Memory (U12.E3)
DDR_D1: P03_Processor 1 of 3, JTAG Header (U5.M4), P07_DDR3 Memory (U12.F7)
DDR_D2: P03_Processor 1 of 3, JTAG Header (U5.N1), P07_DDR3 Memory (U12.F2)
DDR_D3: P03_Processor 1 of 3, JTAG Header (U5.N2), P07_DDR3 Memory (U12.F8)
DDR_D4: P03_Processor 1 of 3, JTAG Header (U5.N3), P07_DDR3 Memory (U12.H3)
DDR_D5: P03_Processor 1 of 3, JTAG Header (U5.N4), P07_DDR3 Memory (U12.H8)
DDR_D6: P03_Processor 1 of 3, JTAG Header (U5.P3), P07_DDR3 Memory (U12.G2)
DDR_D7: P03_Processor 1 of 3, JTAG Header (U5.P4), P07_DDR3 Memory (U12.H7)
DDR_D8: P03_Processor 1 of 3, JTAG Header (U5.J1), P07_DDR3 Memory (U12.D7)
DDR_D9: P03_Processor 1 of 3, JTAG Header (U5.K1), P07_DDR3 Memory (U12.C3)
DDR_D10: P03_Processor 1 of 3, JTAG Header (U5.K2), P07_DDR3 Memory (U12.C8)
DDR_D11: P03_Processor 1 of 3, JTAG Header (U5.K3), P07_DDR3 Memory (U12.C2)
DDR_D12: P03_Processor 1 of 3, JTAG Header (U5.K4), P07_DDR3 Memory (U12.A7)
DDR_D13: P03_Processor 1 of 3, JTAG Header (U5.L3), P07_DDR3 Memory (U12.A2)
DDR_D14: P03_Processor 1 of 3, JTAG Header (U5.L4), P07_DDR3 Memory (U12.B8)
DDR_D15: P03_Processor 1 of 3, JTAG Header (U5.M1), P07_DDR3 Memory (U12.A3)
DDR_DQM0: P03_Processor 1 of 3, JTAG Header (U5.M2), P07_DDR3 Memory (U12.E7)
DDR_DQM1: P03_Processor 1 of 3, JTAG Header (U5.J2), P07_DDR3 Memory (U12.D3)
DDR_DQS0: P03_Processor 1 of 3, JTAG Header (U5.P1), P07_DDR3 Memory (U12.F3)
DDR_DQS1: P03_Processor 1 of 3, JTAG Header (U5.L1), P07_DDR3 Memory (U12.C7)
DDR_DQSN0: P03_Processor 1 of 3, JTAG Header (U5.P2), P07_DDR3 Memory (U12.G3)
DDR_DQSN1: P03_Processor 1 of 3, JTAG Header (U5.L2), P07_DDR3 Memory (U12.B7)
DDR_ODT: P03_Processor 1 of 3, JTAG Header (U5.G1), P07_DDR3 Memory (U12.K1)
DDR_RASn: P03_Processor 1 of 3, JTAG Header (U5.G4), P07_DDR3 Memory (U12.J3)
DDR_RESETn: P03_Processor 1 of 3, JTAG Header (U5.G2), P07_DDR3 Memory (R97.2 U12.T2)
DDR_WEn: P03_Processor 1 of 3, JTAG Header (U5.B2), P07_DDR3 Memory (U12.L3)
EHRPWM1A: P03_Processor 1 of 3, JTAG Header (U5.U14), P11_Exp Conn, uSD, and  (P9.14)
EHRPWM1B: P03_Processor 1 of 3, JTAG Header (U5.T14), P11_Exp Conn, uSD, and  (P9.16)
EHRPWM2A: P03_Processor 1 of 3, JTAG Header (U5.U10), P11_Exp Conn, uSD, and  (P8.19)
EHRPWM2B: P03_Processor 1 of 3, JTAG Header (U5.T10), P11_Exp Conn, uSD, and  (P8.13)
eMMC_RSTn: P03_Processor 1 of 3, JTAG Header (R162.2), P08_eMMC (R111.2 U13.K5)
GPIO0_7: P04_Processor 2 or 3, USB and Serial (R50.1 R51.1), P11_Exp Conn, uSD, and  (P9.42)
GPIO0_26: P03_Processor 1 of 3, JTAG Header (U5.T11), P11_Exp Conn, uSD, and  (P8.14)
GPIO0_27: P03_Processor 1 of 3, JTAG Header (U5.U12), P11_Exp Conn, uSD, and  (P8.17)
GPIO1_12: P03_Processor 1 of 3, JTAG Header (U5.T12), P11_Exp Conn, uSD, and  (P8.12)
GPIO1_13: P03_Processor 1 of 3, JTAG Header (U5.R12), P11_Exp Conn, uSD, and  (P8.11)
GPIO1_14: P03_Processor 1 of 3, JTAG Header (U5.V13), P11_Exp Conn, uSD, and  (P8.16)
GPIO1_15: P03_Processor 1 of 3, JTAG Header (U5.U13), P11_Exp Conn, uSD, and  (P8.15)
GPIO1_16: P03_Processor 1 of 3, JTAG Header (R160.2 R161.2), P11_Exp Conn, uSD, and  (P9.15)
GPIO1_17: P03_Processor 1 of 3, JTAG Header (U5.V14), P11_Exp Conn, uSD, and  (P9.23)
GPIO1_28: P03_Processor 1 of 3, JTAG Header (U5.U18), P11_Exp Conn, uSD, and  (P9.12)
GPIO1_29: P03_Processor 1 of 3, JTAG Header (U5.V6), P11_Exp Conn, uSD, and  (P8.26)
GPIO2_1: P03_Processor 1 of 3, JTAG Header (U5.V12), P11_Exp Conn, uSD, and  (P8.18)
GPIO3_19: P04_Processor 2 or 3, USB and Serial (U5.C13), P11_Exp Conn, uSD, and  (P9.27)
GPIO3_20: P03_Processor 1 of 3, JTAG Header (R20.2), P04_Processor 2 or 3, USB and Serial (U5.D13)
GPIO3_21: P03_Processor 1 of 3, JTAG Header (R167.2), P04_Processor 2 or 3, USB and Serial (U5.A14), P11_Exp Conn, uSD, and  (P9.25)
HDMI_INT: P03_Processor 1 of 3, JTAG Header (U5.U16), P10_HDMI Framer (R158.2 U11.50)
I2C0_SCL: P02_Power Management (R3.2 U2.28), P04_Processor 2 or 3, USB and Serial (U5.C16), P10_HDMI Framer (U11.52), P11_Exp Conn, uSD, and  (U7.1)
I2C0_SDA: P02_Power Management (R4.2 U2.27), P04_Processor 2 or 3, USB and Serial (U5.C17), P10_HDMI Framer (U11.51), P11_Exp Conn, uSD, and  (U7.3)
I2C1_SCL: P04_Processor 2 or 3, USB and Serial (U5.A16), P11_Exp Conn, uSD, and  (P9.17)
I2C1_SDA: P04_Processor 2 or 3, USB and Serial (U5.B16), P11_Exp Conn, uSD, and  (P9.18)
I2C2_SCL: P04_Processor 2 or 3, USB and Serial (U5.D17), P11_Exp Conn, uSD, and  (P9.19)
I2C2_SDA: P04_Processor 2 or 3, USB and Serial (U5.D18), P11_Exp Conn, uSD, and  (P9.20)
LCD_DATA0: P04_Processor 2 or 3, USB and Serial (U5.R1), P06_LED, Config, & Button (R70.2 R95.1), P10_HDMI Framer (C173.1 U11.15), P11_Exp Conn, uSD, and  (P8.45)
LCD_DATA1: P04_Processor 2 or 3, USB and Serial (U5.R2), P06_LED, Config, & Button (R69.2 R94.1), P10_HDMI Framer (C171.1 U11.13), P11_Exp Conn, uSD, and  (P8.46)
LCD_DATA2: P04_Processor 2 or 3, USB and Serial (U5.R3), P06_LED, Config, & Button (R68.2 R75.1 R93.1), P10_HDMI Framer (C172.1 U11.12), P11_Exp Conn, uSD, and  (P8.43)
LCD_DATA3: P04_Processor 2 or 3, USB and Serial (U5.R4), P06_LED, Config, & Button (R67.2 R92.1), P10_HDMI Framer (C170.1 U11.11), P11_Exp Conn, uSD, and  (P8.44)
LCD_DATA4: P04_Processor 2 or 3, USB and Serial (U5.T1), P06_LED, Config, & Button (R66.2 R91.1), P10_HDMI Framer (C169.1 U11.10), P11_Exp Conn, uSD, and  (P8.41)
LCD_DATA5: P04_Processor 2 or 3, USB and Serial (U5.T2), P06_LED, Config, & Button (R65.2 R90.1), P10_HDMI Framer (C163.1 U11.7), P11_Exp Conn, uSD, and  (P8.42)
LCD_DATA6: P04_Processor 2 or 3, USB and Serial (U5.T3), P06_LED, Config, & Button (R64.2 R89.1), P10_HDMI Framer (C162.1 U11.6), P11_Exp Conn, uSD, and  (P8.39)
LCD_DATA7: P04_Processor 2 or 3, USB and Serial (U5.T4), P06_LED, Config, & Button (R63.2 R88.1), P10_HDMI Framer (C161.1 U11.3), P11_Exp Conn, uSD, and  (P8.40)
LCD_DATA8: P04_Processor 2 or 3, USB and Serial (U5.U1), P06_LED, Config, & Button (R62.2 R87.1), P10_HDMI Framer (C160.1 U11.2), P11_Exp Conn, uSD, and  (P8.37)
LCD_DATA9: P04_Processor 2 or 3, USB and Serial (U5.U2), P06_LED, Config, & Button (R61.2 R86.1), P10_HDMI Framer (C157.1 U11.1), P11_Exp Conn, uSD, and  (P8.38)
LCD_DATA10: P04_Processor 2 or 3, USB and Serial (U5.U3), P06_LED, Config, & Button (R60.2 R85.1), P10_HDMI Framer (C156.1 U11.64), P11_Exp Conn, uSD, and  (P8.36)
LCD_DATA11: P04_Processor 2 or 3, USB and Serial (U5.U4), P06_LED, Config, & Button (R59.2 R84.1), P10_HDMI Framer (C168.1 U11.60), P11_Exp Conn, uSD, and  (P8.34)
LCD_DATA12: P04_Processor 2 or 3, USB and Serial (U5.V2), P06_LED, Config, & Button (R58.2 R83.1), P10_HDMI Framer (C167.1 U11.59), P11_Exp Conn, uSD, and  (P8.35)
LCD_DATA13: P04_Processor 2 or 3, USB and Serial (U5.V3), P06_LED, Config, & Button (R57.2 R82.1), P10_HDMI Framer (C166.1 U11.58), P11_Exp Conn, uSD, and  (P8.33)
LCD_DATA14: P04_Processor 2 or 3, USB and Serial (U5.V4), P06_LED, Config, & Button (R56.2 R81.1), P10_HDMI Framer (C165.1 U11.57), P11_Exp Conn, uSD, and  (P8.31)
LCD_DATA15: P04_Processor 2 or 3, USB and Serial (U5.T5), P06_LED, Config, & Button (R55.2 R80.1), P10_HDMI Framer (C164.1 U11.56), P11_Exp Conn, uSD, and  (P8.32)
LCD_DE: P04_Processor 2 or 3, USB and Serial (R48.2), P10_HDMI Framer (U11.20), P11_Exp Conn, uSD, and  (P8.30)
LCD_HSYNC: P04_Processor 2 or 3, USB and Serial (R47.2), P10_HDMI Framer (U11.22), P11_Exp Conn, uSD, and  (P8.29)
LCD_PCLK: P04_Processor 2 or 3, USB and Serial (R45.2), P10_HDMI Framer (U11.4), P11_Exp Conn, uSD, and  (P8.28)
LCD_VSYNC: P04_Processor 2 or 3, USB and Serial (R46.2), P10_HDMI Framer (U11.21), P11_Exp Conn, uSD, and  (P8.27)
LDO_PGOOD: P02_Power Management (U2.46), P03_Processor 1 of 3, JTAG Header (U5.B5)
MDIO_CLK: P04_Processor 2 or 3, USB and Serial (U5.M18), P09_Ethernet (U14.17)
MDIO_DATA: P04_Processor 2 or 3, USB and Serial (U5.M17), P09_Ethernet (R119.2 U14.16)
MII1_COL: P04_Processor 2 or 3, USB and Serial (U5.H16), P09_Ethernet (R138.1)
MII1_CRS_DV: P04_Processor 2 or 3, USB and Serial (U5.H17), P09_Ethernet (R139.1)
MII1_REFCLK: P04_Processor 2 or 3, USB and Serial (R28.2), P09_Ethernet (R124.1 R140.1)
MII1_RXCLK: P04_Processor 2 or 3, USB and Serial (U5.L18), P09_Ethernet (R131.1)
MII1_RXD0: P04_Processor 2 or 3, USB and Serial (U5.M16), P09_Ethernet (R128.1)
MII1_RXD1: P04_Processor 2 or 3, USB and Serial (U5.L15), P09_Ethernet (R127.1)
MII1_RXD2: P04_Processor 2 or 3, USB and Serial (U5.L16), P09_Ethernet (R126.1)
MII1_RXD3: P04_Processor 2 or 3, USB and Serial (U5.L17), P09_Ethernet (R125.1)
MII1_RXDV: P04_Processor 2 or 3, USB and Serial (U5.J17), P09_Ethernet (R129.1)
MII1_RXERR: P04_Processor 2 or 3, USB and Serial (U5.J15), P09_Ethernet (R133.1)
MII1_TXCLK: P04_Processor 2 or 3, USB and Serial (U5.K18), P09_Ethernet (R134.1)
MII1_TXD0: P04_Processor 2 or 3, USB and Serial (U5.K17), P09_Ethernet (U14.22)
MII1_TXD1: P04_Processor 2 or 3, USB and Serial (U5.K16), P09_Ethernet (U14.23)
MII1_TXD2: P04_Processor 2 or 3, USB and Serial (U5.K15), P09_Ethernet (U14.24)
MII1_TXD3: P04_Processor 2 or 3, USB and Serial (U5.J18), P09_Ethernet (U14.25)
MII1_TXEN: P04_Processor 2 or 3, USB and Serial (U5.J16), P09_Ethernet (U14.21)
MMC0_CD: P03_Processor 1 of 3, JTAG Header (P2.19), P04_Processor 2 or 3, USB and Serial (U5.C15), P11_Exp Conn, uSD, and  (P10.10 R157.1)
MMC0_CLKO: P03_Processor 1 of 3, JTAG Header (U5.G17), P11_Exp Conn, uSD, and  (P10.5 R152.2)
MMC0_CMD: P03_Processor 1 of 3, JTAG Header (U5.G18), P11_Exp Conn, uSD, and  (P10.3 R151.2)
MMC0_DAT0: P03_Processor 1 of 3, JTAG Header (U5.G16), P11_Exp Conn, uSD, and  (P10.7 R153.2)
MMC0_DAT1: P03_Processor 1 of 3, JTAG Header (U5.G15), P11_Exp Conn, uSD, and  (P10.8 R154.2)
MMC0_DAT2: P03_Processor 1 of 3, JTAG Header (U5.F18), P11_Exp Conn, uSD, and  (P10.1 R150.2)
MMC0_DAT3: P03_Processor 1 of 3, JTAG Header (U5.F17), P11_Exp Conn, uSD, and  (P10.2 R155.2)
MMC1_CLK: P03_Processor 1 of 3, JTAG Header (U5.U9), P08_eMMC (R110.2 U13.M6), P11_Exp Conn, uSD, and  (P8.21)
MMC1_CMD: P03_Processor 1 of 3, JTAG Header (U5.V9), P08_eMMC (R109.2 U13.M5), P11_Exp Conn, uSD, and  (P8.20)
MMC1_DAT0: P03_Processor 1 of 3, JTAG Header (U5.U7), P08_eMMC (R101.2 U13.A3), P11_Exp Conn, uSD, and  (P8.25)
MMC1_DAT1: P03_Processor 1 of 3, JTAG Header (U5.V7), P08_eMMC (R102.2 U13.A4), P11_Exp Conn, uSD, and  (P8.24)
MMC1_DAT2: P03_Processor 1 of 3, JTAG Header (U5.R8), P08_eMMC (R103.2 U13.A5), P11_Exp Conn, uSD, and  (P8.5)
MMC1_DAT3: P03_Processor 1 of 3, JTAG Header (U5.T8), P08_eMMC (R104.2 U13.B2), P11_Exp Conn, uSD, and  (P8.6)
MMC1_DAT4: P03_Processor 1 of 3, JTAG Header (U5.U8), P08_eMMC (R105.2 U13.B3), P11_Exp Conn, uSD, and  (P8.23)
MMC1_DAT5: P03_Processor 1 of 3, JTAG Header (U5.V8), P08_eMMC (R106.2 U13.B4), P11_Exp Conn, uSD, and  (P8.22)
MMC1_DAT6: P03_Processor 1 of 3, JTAG Header (U5.R9), P08_eMMC (R107.2 U13.B5), P11_Exp Conn, uSD, and  (P8.3)
MMC1_DAT7: P03_Processor 1 of 3, JTAG Header (U5.T9), P08_eMMC (R108.2 U13.B6), P11_Exp Conn, uSD, and  (P8.4)
PMIC_INT: P02_Power Management (R1.2 U2.45), P03_Processor 1 of 3, JTAG Header (U5.B18)
PMIC_PGOOD: P02_Power Management (U2.26), P03_Processor 1 of 3, JTAG Header (U5.B15)
PMIC_POWR_EN: P02_Power Management (U2.9), P04_Processor 2 or 3, USB and Serial (U5.C6)
PWR_BUT: P02_Power Management (S3.2 S3.4 U2.25), P11_Exp Conn, uSD, and  (P9.9)
SPI1_CS0: P04_Processor 2 or 3, USB and Serial (U5.C12), P10_HDMI Framer (U11.25), P11_Exp Conn, uSD, and  (P9.28)
SPI1_D0: P04_Processor 2 or 3, USB and Serial (U5.B13), P10_HDMI Framer (U11.24), P11_Exp Conn, uSD, and  (P9.29)
SPI1_D1: P04_Processor 2 or 3, USB and Serial (U5.D12), P11_Exp Conn, uSD, and  (P9.30)
SPI1_SCLK: P04_Processor 2 or 3, USB and Serial (U5.A13), P10_HDMI Framer (U11.23), P11_Exp Conn, uSD, and  (P9.31)
SYS_RESETn: P03_Processor 1 of 3, JTAG Header (7 pins), P09_Ethernet (U14.19), P11_Exp Conn, uSD, and  (P9.10)
TIMER4: P03_Processor 1 of 3, JTAG Header (U5.R7), P11_Exp Conn, uSD, and  (P8.7)
TIMER5: P03_Processor 1 of 3, JTAG Header (U5.T6), P11_Exp Conn, uSD, and  (P8.9)
TIMER6: P03_Processor 1 of 3, JTAG Header (U5.U6), P11_Exp Conn, uSD, and  (P8.10)
TIMER7: P03_Processor 1 of 3, JTAG Header (U5.T7), P11_Exp Conn, uSD, and  (P8.8)
UART1_RXD: P04_Processor 2 or 3, USB and Serial (U5.D16), P11_Exp Conn, uSD, and  (P9.26)
UART1_TXD: P04_Processor 2 or 3, USB and Serial (U5.D15), P11_Exp Conn, uSD, and  (P9.24)
UART2_RXD: P04_Processor 2 or 3, USB and Serial (U5.A17), P11_Exp Conn, uSD, and  (P9.22)
UART2_TXD: P04_Processor 2 or 3, USB and Serial (U5.B17), P11_Exp Conn, uSD, and  (P9.21)
UART4_RXD: P03_Processor 1 of 3, JTAG Header (U5.T17), P11_Exp Conn, uSD, and  (P9.11)
UART4_TXD: P03_Processor 1 of 3, JTAG Header (U5.U17), P11_Exp Conn, uSD, and  (P9.13)
USB1_OCn: P03_Processor 1 of 3, JTAG Header (U5.T16), P04_Processor 2 or 3, USB and Serial (R52.2 U8.5)
USR0: P03_Processor 1 of 3, JTAG Header (U5.V15), P06_LED, Config, & Button (Q1.2 R76.1)
USR1: P03_Processor 1 of 3, JTAG Header (U5.U15), P06_LED, Config, & Button (Q1.5 R77.1)
USR2: P03_Processor 1 of 3, JTAG Header (U5.T15), P06_LED, Config, & Button (Q2.2 R78.1)
USR3: P03_Processor 1 of 3, JTAG Header (U5.V16), P06_LED, Config, & Button (Q2.5 R79.1)
WAKEUP: P02_Power Management (U2.13), P04_Processor 2 or 3, USB and Serial (R26.2 U5.C5)

## Assembly variants
Default: not fitted C137 C138 C139 C140 P2 R9 R57 R58 R59 R60 R61 R62 R63 R64 R69 R70 R81 R90 R91 R92 R93 R124 R140 R141